# EAGLE design Shruthi-ControlPanel-v01 (EAGLE 5.07)
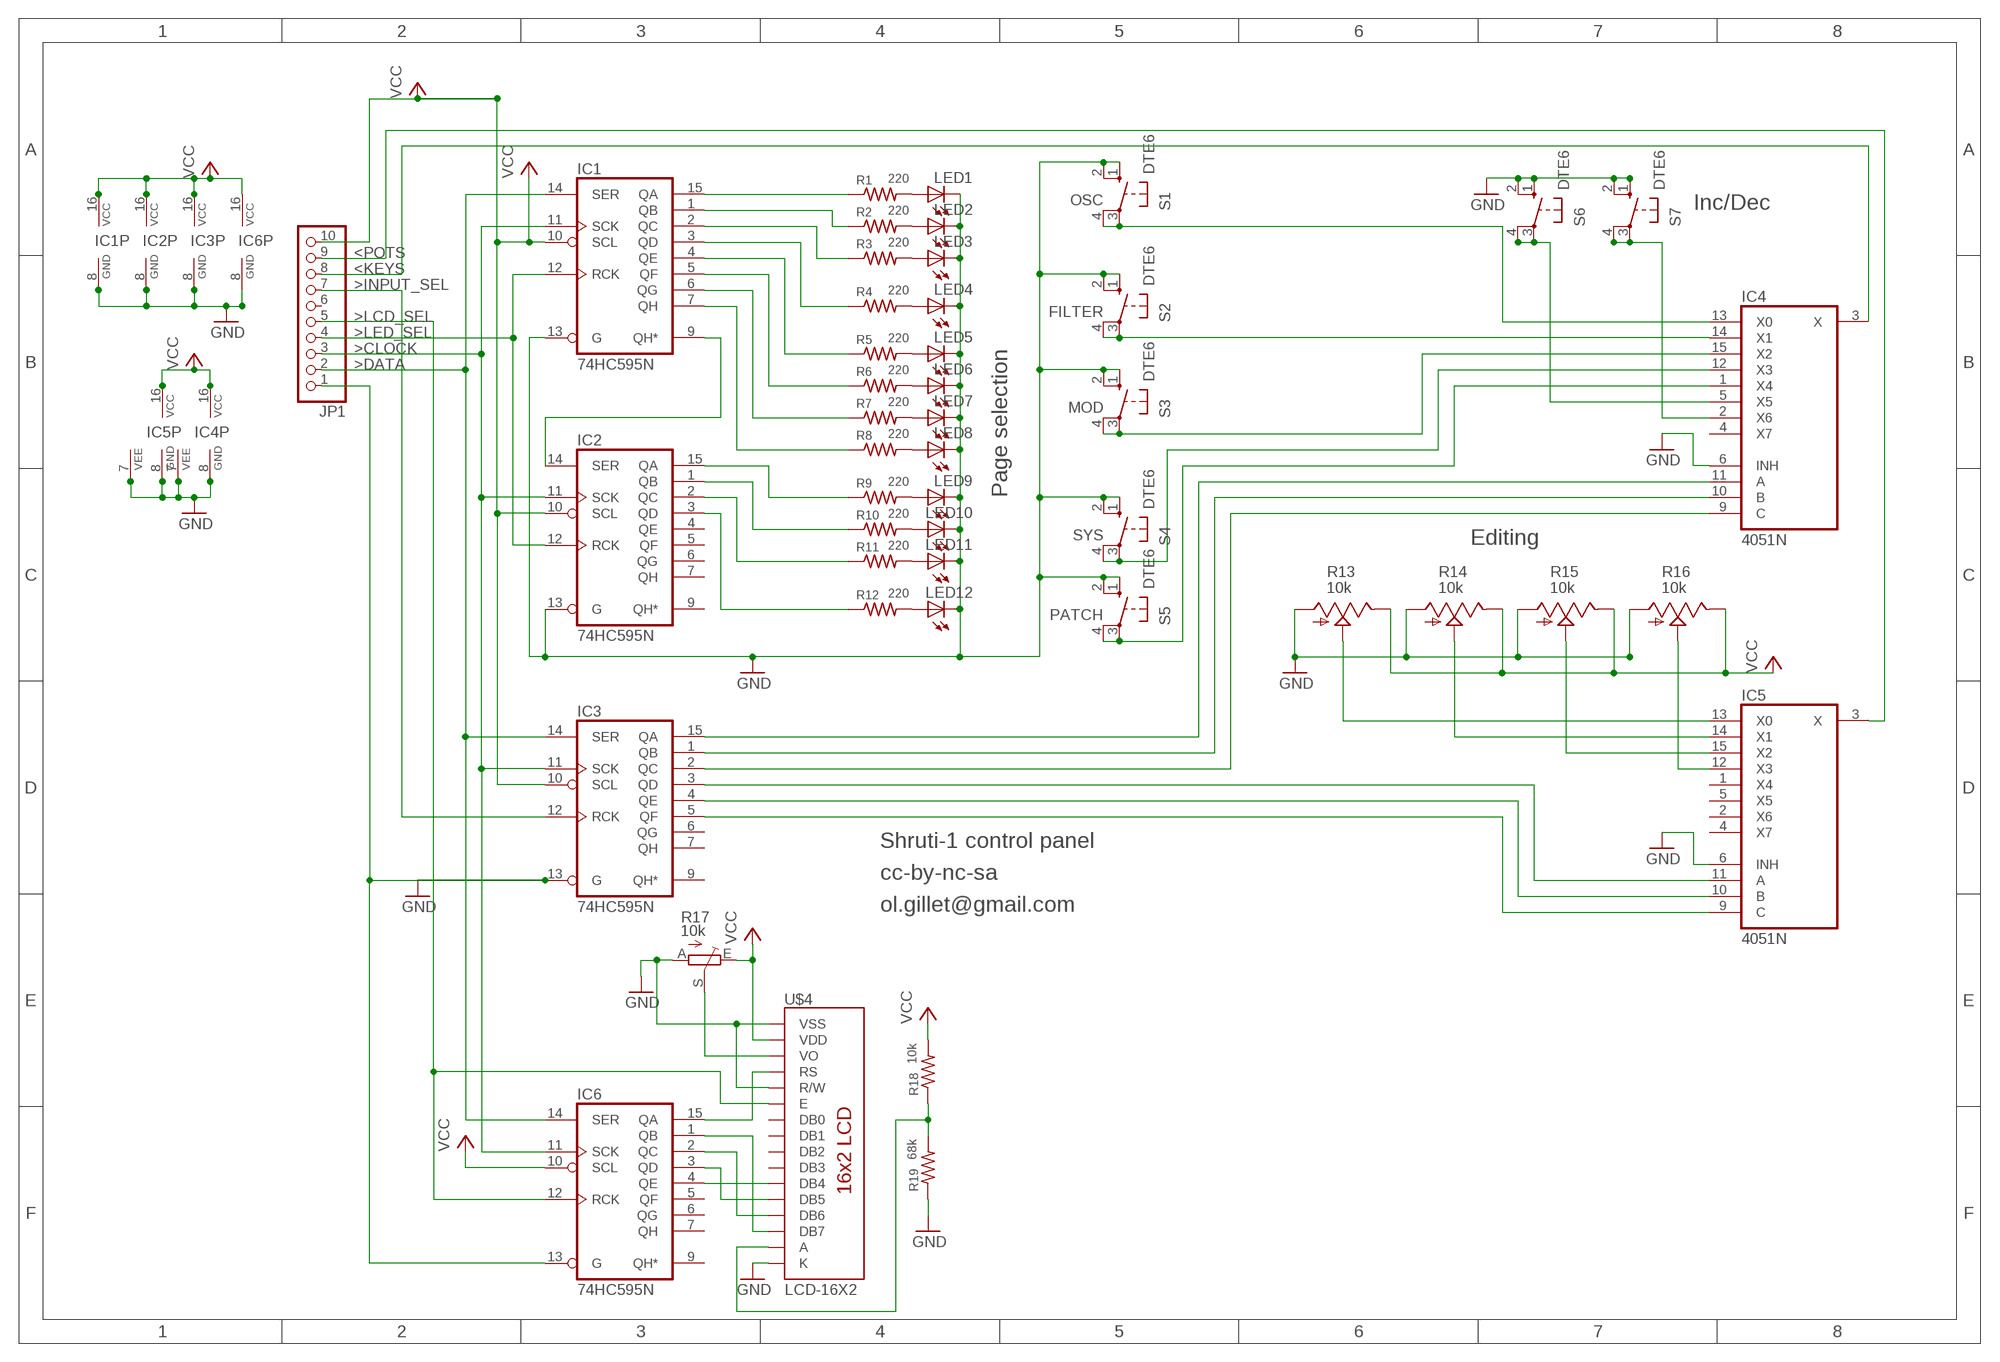
[diagram p0: schematic, sheet 1]

## Parts
IC1  74HC595N  [DIL16]
IC2  74HC595N  [DIL16]
IC3  74HC595N  [DIL16]
IC4  4051N  [DIL16]
IC5  4051N  [DIL16]
IC6  74HC595N  [DIL16]
JP1  PINHD-1X10  [1X10]
LED1  LED3MM  [LED3MM]
LED2  LED3MM  [LED3MM]
LED3  LED3MM  [LED3MM]
LED4  LED3MM  [LED3MM]
LED5  LED3MM  [LED3MM]
LED6  LED3MM  [LED3MM]
LED7  LED3MM  [LED3MM]
LED8  LED3MM  [LED3MM]
LED9  LED3MM  [LED3MM]
LED10  LED3MM  [LED3MM]
LED11  LED3MM  [LED3MM]
LED12  LED3MM  [LED3MM]
R1  220  R-US_0204/7  [0204/7]
R2  220  R-US_0204/7  [0204/7]
R3  220  R-US_0204/7  [0204/7]
R4  220  R-US_0204/7  [0204/7]
R5  220  R-US_0204/7  [0204/7]
R6  220  R-US_0204/7  [0204/7]
R7  220  R-US_0204/7  [0204/7]
R8  220  R-US_0204/7  [0204/7]
R9  220  R-US_0204/7  [0204/7]
R10  220  R-US_0204/7  [0204/7]
R11  220  R-US_0204/7  [0204/7]
R12  220  R-US_0204/7  [0204/7]
R13  10k  POT_US  [ALPS_POT_SFE]
R14  10k  POT_US  [ALPS_POT_SFE]
R15  10k  POT_US  [ALPS_POT_SFE]
R16  10k  POT_US  [ALPS_POT_SFE]
R17  10k  TRIM_EU-B25U  [B25U]
R18  10k  R-US_0204/7  [0204/7]
R19  68k  R-US_0204/7  [0204/7]
S1  DTE6  40-XX  [B3F-40XX]
S2  DTE6  40-XX  [B3F-40XX]
S3  DTE6  40-XX  [B3F-40XX]
S4  DTE6  40-XX  [B3F-40XX]
S5  DTE6  40-XX  [B3F-40XX]
S6  DTE6  40-XX  [B3F-40XX]
S7  DTE6  40-XX  [B3F-40XX]
U$4  LCD-16X2  [LCD-16X2]

## Nets
<KEYS: IC4.3(X) JP1.8
<POTS: IC5.3(X) JP1.9
>CLOCK: IC1.11(SCK) IC2.11(SCK) IC3.11(SCK) IC6.11(SCK) JP1.3
>DATA: IC1.14(SER) IC3.14(SER) IC6.14(SER) JP1.2
>INPUT_SEL: IC3.12(RCK) JP1.7
>LCD_SEL: IC6.12(RCK) JP1.5 U$4.6(E)
>LED_SEL: IC1.12(RCK) IC2.12(RCK) JP1.4
GND: IC1.8(GND) IC1.13(G) IC2.8(GND) IC2.13(G) IC3.8(GND) IC3.13(G) IC4.6(INH) IC4.7(VEE) IC4.8(GND) IC5.6(INH) IC5.7(VEE) IC5.8(GND) IC6.8(GND) IC6.13(G) JP1.1 LED1.K(C) LED2.K(C) LED3.K(C) LED4.K(C) LED5.K(C) LED6.K(C) LED7.K(C) LED8.K(C) LED9.K(C) LED10.K(C) LED11.K(C) LED12.K(C) R13.P$3(A) R14.P$3(A) R15.P$3(A) R16.P$3(A) R17.A R19.1 S1.1(S) S1.2(S1) S2.1(S) S2.2(S1) S3.1(S) S3.2(S1) S4.1(S) S4.2(S1) S5.1(S) S5.2(S1) S6.1(S) S6.2(S1) S7.1(S) S7.2(S1) U$4.1(VSS) U$4.5(R/W) U$4.16(K)
N$1: IC1.9(QH*) IC2.14(SER)
N$2: LED1.A R1.2
N$3: LED2.A R2.2
N$4: LED3.A R3.2
N$5: LED4.A R4.2
N$6: LED5.A R5.2
N$7: LED6.A R6.2
N$8: LED7.A R7.2
N$9: LED9.A R9.2
N$10: LED10.A R10.2
N$11: LED11.A R11.2
N$12: LED12.A R12.2
N$13: IC1.15(QA) R1.1
N$14: IC1.1(QB) R2.1
N$15: IC1.2(QC) R3.1
N$16: IC1.3(QD) R4.1
N$17: IC1.4(QE) R5.1
N$18: IC1.5(QF) R6.1
N$19: IC1.6(QG) R7.1
N$20: IC1.7(QH) R8.1
N$21: LED8.A R8.2
N$22: IC2.15(QA) R9.1
N$23: IC2.1(QB) R10.1
N$24: IC2.2(QC) R11.1
N$25: IC3.15(QA) IC4.11(A)
N$26: IC3.1(QB) IC4.10(B)
N$27: IC2.3(QD) R12.1
N$28: IC6.15(QA) U$4.4(RS)
N$29: R17.S U$4.3(VO)
N$30: IC6.1(QB) U$4.14(DB7)
N$31: IC3.2(QC) IC4.9(C)
N$32: IC3.3(QD) IC5.11(A)
N$33: IC3.4(QE) IC5.10(B)
N$34: IC3.5(QF) IC5.9(C)
N$35: IC5.13(X0) R13.P$2(S)
N$36: IC4.5(X5) S6.3(P) S6.4(P1)
N$37: IC5.14(X1) R14.P$2(S)
N$38: IC5.15(X2) R15.P$2(S)
N$39: IC5.12(X3) R16.P$2(S)
N$40: IC4.2(X6) S7.3(P) S7.4(P1)
N$41: IC4.13(X0) S1.3(P) S1.4(P1)
N$42: IC4.14(X1) S2.3(P) S2.4(P1)
N$43: IC4.15(X2) S3.3(P) S3.4(P1)
N$44: IC4.12(X3) S4.3(P) S4.4(P1)
N$45: IC4.1(X4) S5.3(P) S5.4(P1)
N$47: IC6.2(QC) U$4.13(DB6)
N$48: IC6.3(QD) U$4.12(DB5)
N$49: IC6.4(QE) U$4.11(DB4)
N$51: R18.1 R19.2 U$4.15(A)
VCC: IC1.10(SCL) IC1.16(VCC) IC2.10(SCL) IC2.16(VCC) IC3.10(SCL) IC3.16(VCC) IC4.16(VCC) IC5.16(VCC) IC6.10(SCL) IC6.16(VCC) JP1.10 R13.P$1(E) R14.P$1(E) R15.P$1(E) R16.P$1(E) R17.E R18.2 U$4.2(VDD)
Unconnected: IC2.4(QE) IC2.5(QF) IC2.6(QG) IC2.7(QH) IC2.9(QH*) IC3.6(QG) IC3.7(QH) IC3.9(QH*) IC4.4(X7) IC5.1(X4) IC5.2(X6) IC5.4(X7) IC5.5(X5) IC6.5(QF) IC6.6(QG) IC6.7(QH) IC6.9(QH*) JP1.6 U$4.7(DB0) U$4.8(DB1) U$4.9(DB2) U$4.10(DB3)

## Notes on the sheet
- OSC
- Inc/Dec
- FILTER
- MOD
- Page selection
- SYS
- Editing
- PATCH
- Shruti-1 control panel
- cc-by-nc-sa
- ol.gillet@gmail.com

## Library data of the parts
IC1-IC3 IC6 = 74xx-eu:74*595: 8-bit SHIFT REGISTER, output latch
IC4 IC5 = 40xx:4051: 8-channel ANALOG MULTIPLEXER
JP1 = pinhead:PINHD-1X10: PIN HEADER
LED1-LED12 = led:LED: LED OSRAM: - CHIPLED LG R971, LG N971, LY N971, LG Q971, LY Q971, LO R971, LY R971 LH N974, LH R974 LS Q976, LO Q976, LY Q976 LO Q996 - Hyper CHIPLED LW Q18S LB Q993, LB Q99A, LB R99A - SideLED LS A670, LO A670, LY A670, LG A670, LP A670 LB A673, LV A673, LT A673, LW A673 LH A674 LY A675 LS A676, LA A676, LO A676, LY A676, LW A676 LS A679, LY A679, LG A679 - Hyper Micro SIDELED® LS Y876, LA Y876, LO Y876, LY Y876 LT Y87S - SmartLED LW L88C, LW L88S LB L89C, LB L89S, LG L890 LS L89K, LO L89K, LY L89K LS L896, LA L896, LO L896, LY L896 - TOPLED LS T670, LO T670, LY T670, LG T670, LP T670 LSG T670, LSP T670, LSY T670, LOP T670, LYG T670 LG T671, LOG T671, LSG T671 LB T673, LV T673, LT T673, LW T673 LH T674 LS T676, LA T676, LO T676, LY T676, LB T676, LH T676, LSB T676, LW T676 LB T67C, LV T67C, LT T67C, LS T67K, LO T67K, LY T67K, LW E67C LS E67B, LA E67B, LO E67B, LY E67B, LB E67C, LV E67C, LT E67C LW T67C LS T679, LY T679, LG T679 LS T770, LO T770, LY T770, LG T770, LP T770 LB T773, LV T773, LT T773, LW T773 LH T774 LS E675, LA E675, LY E675, LS T675 LS T776, LA T776, LO T776, LY T776, LB T776 LHGB T686 LT T68C, LB T68C - Hyper Mini TOPLED® LB M676 - Mini TOPLED Santana® LG M470 LS M47K, LO M47K, LY M47K Source: http://www.osram.convergy.de LUXEON: - LUMILED® LXK2-PW12-R00, LXK2-PW12-S00, LXK2-PW14-U00, LXK2-PW14-V00 LXK2-PM12-R00, LXK2-PM12-S00, LXK2-PM14-U00 LXK2-PE12-Q00, LXK2-PE12-R00, LXK2-PE12-S00, LXK2-PE14-T00, LXK2-PE14-U00 LXK2-PB12-K00, LXK2-PB12-L00, LXK2-PB12-M00, LXK2-PB14-N00, LXK2-PB14-P00, LXK2-PB14-Q00 LXK2-PR12-L00, LXK2-PR12-M00, LXK2-PR14-Q00, LXK2-PR14-R00 LXK2-PD12-Q00, LXK2-PD12-R00, LXK2-PD12-S00 LXK2-PH12-R00, LXK2-PH12-S00 LXK2-PL12-P00, LXK2-PL12-Q00, LXK2-PL12-R00 Source: www.luxeon.com KINGBRIGHT: KA-3528ASYC Source: www.kingbright.com
R1-R12 R18 R19 = resistor:R-US_: RESISTOR, American symbol
R13-R16 = pot-alps:POT_US
R17 = pot:TRIM_EU-: POTENTIOMETER
S1-S7 = switch-omron:40-XX: OMRON SWITCH
U$4 = SparkFun:LCD-16X2

## Board
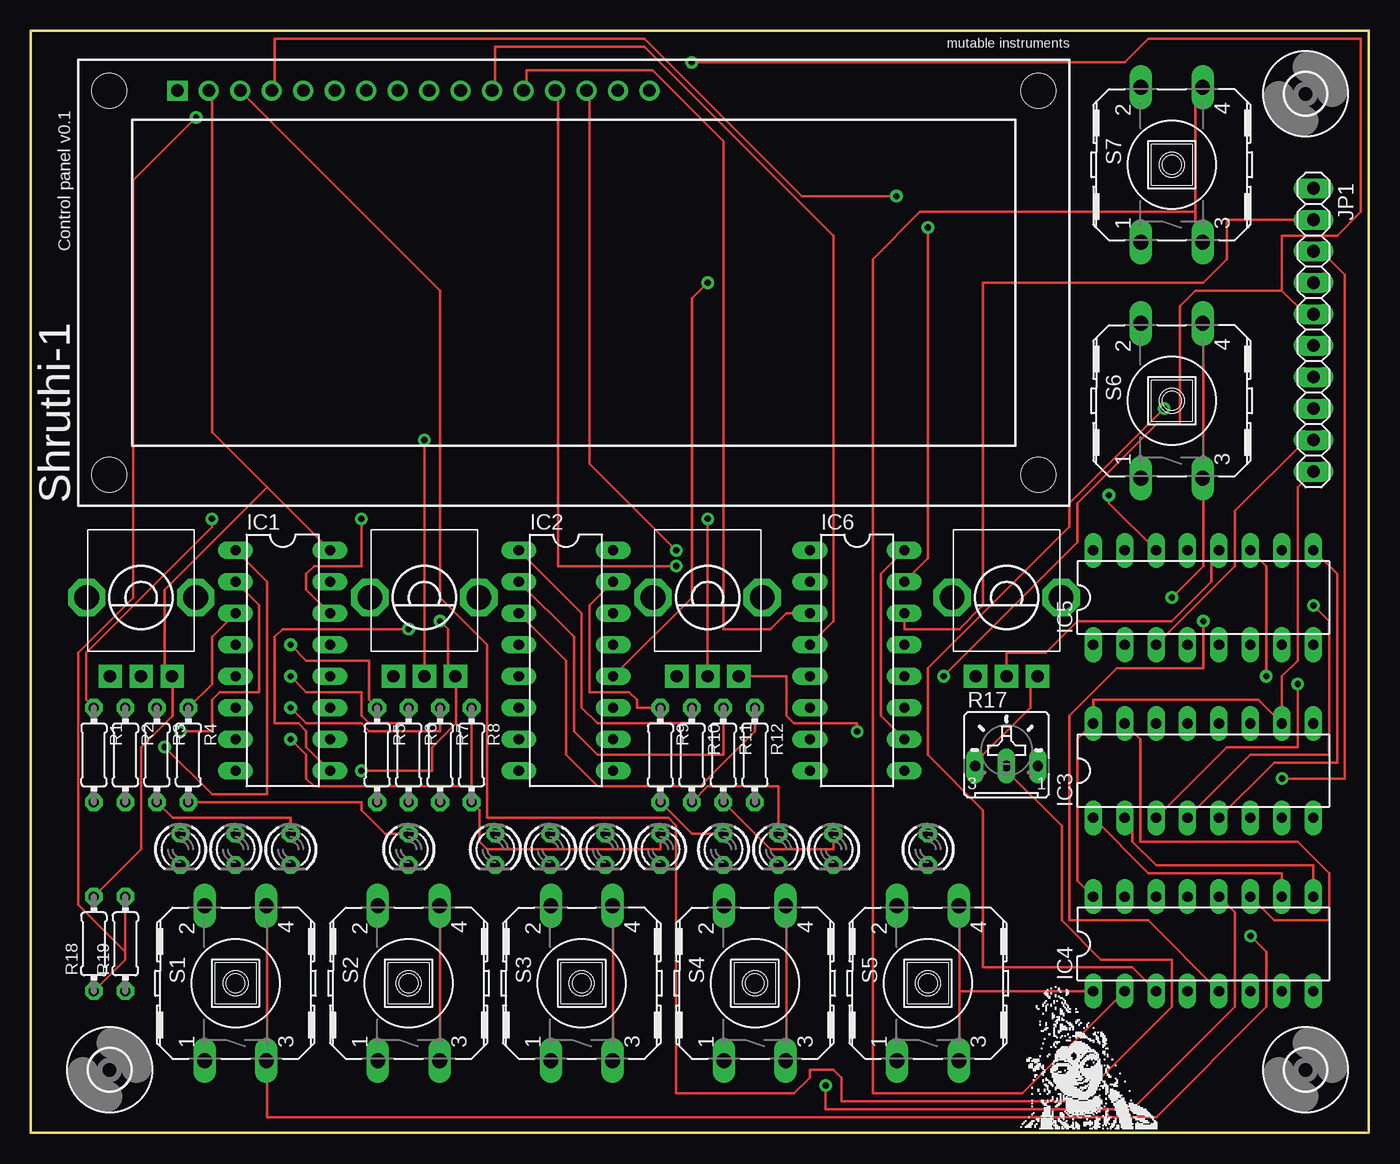
[diagram p1: board, top side]
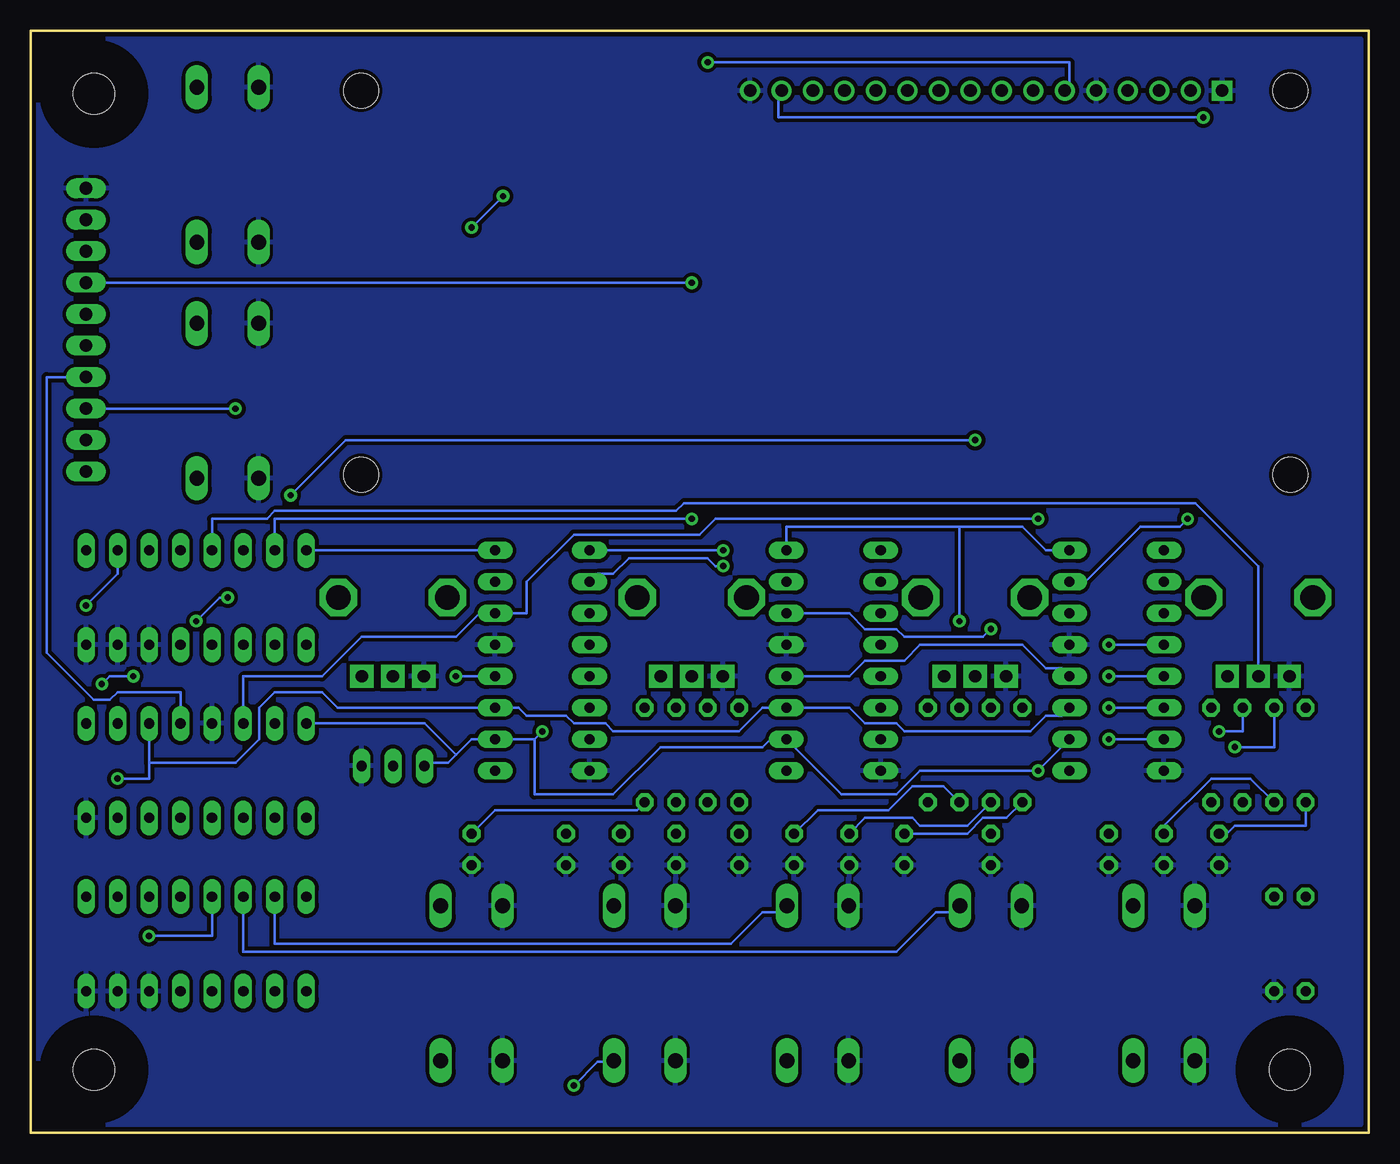
[diagram p2: board, bottom side, seen from below]

Size 107.95 x 88.89 mm. Coordinates in mm from the lower left corner, seen from the top.
Outline: 107.95,0 107.95,88.89 0,88.89 0,0 107.95,0
Copper layers (1*16): Top 0.035mm / dielectric 1.5mm / Bottom 0.035mm
Design rules "SparkFun *": minimum track width 8mil, minimum drill 20mil, track to track 8mil, track to pad 14mil, pad to pad 8mil, via to via 8mil, smd to smd 8mil, copper to edge 10mil, drill to drill 8mil, minimum pad ring 12mil, minimum via ring 10mil, stop-mask expansion 4mil, vias tented up to drill 25mil, thermal gap 10mil

### Footprints (pad centres in the part's own frame; a part is rotated, then mirrored left to right if it is on the bottom)
DIL16 = drill 0.813 long: 1 -8.89,-3.81; 2 -6.35,-3.81; 3 -3.81,-3.81; 4 -1.27,-3.81; 5 1.27,-3.81; 6 3.81,-3.81; 7 6.35,-3.81; 8 8.89,-3.81; 9 8.89,3.81; 10 6.35,3.81; 11 3.81,3.81; 12 1.27,3.81; 13 -1.27,3.81; 14 -3.81,3.81; 15 -6.35,3.81; 16 -8.89,3.81
1X10 = drill 1.016 long: 1 -11.43,0; 2 -8.89,0; 3 -6.35,0; 4 -3.81,0; 5 -1.27,0; 6 1.27,0; 7 3.81,0; 8 6.35,0; 9 8.89,0; 10 11.43,0
LED3MM = drill 0.813 octagon: A -1.27,0; K 1.27,0
0204/7 = drill 0.813 octagon: 1 -3.81,0; 2 3.81,0
ALPS_POT_SFE = drill 1 pad 1.88 square: P$1 -2.5,6.35; P$2 0,6.35; P$3 2.5,6.35 | drill 2 octagon: P$4 -4.4,0; P$5 4.4,0
B25U = drill 0.813 long: A 2.54,-0.889; E -2.54,-0.889; S 0,-0.889
B3F-40XX = drill 1.194 long: 1 -6.248,2.489; 2 6.248,2.489; 3 -6.248,-2.489; 4 6.248,-2.489
3,3 = hole 3.3: 0,0
LCD-16X2 = drill 1.016 square: 1 -32,15.5 | drill 1.016 round: 2 -29.46,15.5; 3 -26.92,15.5; 4 -24.38,15.5; 5 -21.84,15.5; 6 -19.3,15.5; 7 -16.76,15.5; 8 -14.22,15.5; 9 -11.68,15.5; 10 -9.14,15.5; 11 -6.6,15.5; 12 -4.06,15.5; 13 -1.52,15.5; 14 1.02,15.5; 15 3.56,15.5; 16 6.1,15.5 | hole 2.8: -37.5,15.5; -37.5,-15.5; 37.5,15.5; 37.5,-15.5

### Placement (x,y rotation side)
IC1  20.32,38.1 270 top
IC2  43.18,38.1 270 top
IC3  94.62,29.21 0 top
IC4  94.62,15.24 0 top
IC5  94.62,43.18 0 top
IC6  66.68,38.1 270 top
JP1  103.51,64.77 270 top
LED1  12.07,22.86 270 top
LED2  16.51,22.86 270 top
LED3  20.95,22.86 270 top
LED4  30.48,22.86 270 top
LED5  37.46,22.86 270 top
LED6  41.91,22.86 270 top
LED7  46.35,22.86 270 top
LED8  50.8,22.86 270 top
LED9  55.88,22.86 270 top
LED10  60.32,22.86 270 top
LED11  64.77,22.86 270 top
LED12  72.39,22.86 270 top
R1  5.08,30.48 270 top
R2  7.62,30.48 270 top
R3  10.16,30.48 270 top
R4  12.7,30.48 270 top
R5  27.94,30.48 270 top
R6  30.48,30.48 270 top
R7  33.02,30.48 270 top
R8  35.56,30.48 270 top
R9  50.8,30.48 270 top
R10  53.34,30.48 270 top
R11  55.88,30.48 270 top
R12  58.42,30.48 270 top
R13  8.89,43.18 180 top
R14  31.75,43.18 180 top
R15  54.61,43.18 180 top
R16  78.74,43.18 180 top
R17  78.74,30.48 0 top
R18  5.08,15.24 90 top
R19  7.62,15.24 90 top
S1  16.51,12.07 90 top
S2  30.48,12.07 90 top
S3  44.45,12.07 90 top
S4  58.42,12.07 90 top
S5  72.39,12.07 90 top
S6  92.08,59.05 90 top
S7  92.08,78.11 90 top
U$1  [3,3]  102.87,83.82 0 top
U$3  [3,3]  6.35,5.08 0 top
U$4  43.81,68.58 0 top
U$5  [3,3]  102.87,5.08 0 top

### Tracks (layer width: path | path; a pad name or v marks a point on that pad's centre or on a via)
<KEYS  (via drill 0.51)
  Top 0.203: IC4.3 88.9,13.34 76.84,13.34 76.84,26.04 72.39,30.48 72.39,37.47 83.82,48.9 83.82,50.8 v91.44,58.42
  Bottom 0.203: v91.44,58.42 JP1.8
<POTS
  Top 0.203: IC5.3 97.16,45.72 97.16,50.16 102.87,55.88 JP1.9
>CLOCK  (via drill 0.51)
  Top 0.203: v100.97,28.57 106.05,28.57 106.05,69.22 104.14,71.12 JP1.3
  Bottom 0.203: IC1.11 24.77,33.66 26.04,33.66 27.3,32.38 37.46,32.38 38.1,33.02 40.64,33.02 41.91,34.29 IC2.11 48.89,34.29 50.8,32.38 60.96,32.38 61.59,33.02 64.14,33.02 64.77,33.66 67.95,33.66 68.58,34.29 IC6.11 83.19,34.29 84.46,35.56 88.27,35.56 89.54,34.29 89.54,31.75 91.44,29.84 98.43,29.84 | 98.43,29.84 98.43,28.57 v100.97,28.57 | 98.43,29.84 IC3.11
>DATA  (via drill 0.51)
  Top 0.203: IC1.14 22.22,43.82 22.22,45.09 22.86,45.72 26.67,45.72 v26.67,49.53 | JP1.2 96.52,73.66 96.52,70.48 94.62,68.58 76.84,68.58 76.84,42.55 74.93,40.64 70.48,40.64 IC6.14
  Bottom 0.203: v26.67,49.53 52.7,49.53 53.98,48.26 64.14,48.26 67.95,44.45 67.95,41.91 IC6.14 71.76,41.91 73.66,40.01 81.28,40.01 84.46,36.83 90.81,36.83 IC3.14
>INPUT_SEL
  Bottom 0.203: IC3.12 95.89,35.56 100.97,35.56 101.6,34.92 102.87,34.92 106.68,38.73 106.68,60.96 JP1.7
>LCD_SEL  (via drill 0.51)
  Top 0.203: v73.66,36.83 84.46,47.62 84.46,50.8 90.81,57.15 92.71,57.15 92.71,66.67 93.98,67.95 100.97,67.95 | 100.97,67.95 102.87,66.04 JP1.5 | v53.34,86.36 88.27,86.36 90.17,88.27 107.32,88.27 107.32,74.3 105.41,72.39 100.97,72.39 100.97,67.95
  Bottom 0.203: IC6.12 v73.66,36.83 | v53.34,86.36 24.13,86.36 24.13,84.45 U$4.6
>LED_SEL  (via drill 0.51)
  Top 0.203: v54.61,68.58 53.34,67.31 53.34,43.18 IC2.12
  Bottom 0.203: IC1.12 24.77,37.47 26.04,37.47 27.94,39.37 36.2,39.37 37.46,38.1 40.64,38.1 41.91,36.83 IC2.12 | v54.61,68.58 JP1.4
GND
  pour Bottom (isolate 0.305): 0.64,88.27 0.64,0.64 107.32,0.64 107.32,88.27
N$1  (via drill 0.51)
  Top 0.203: IC1.9 22.22,31.11 22.22,32.38 21.59,33.02 19.68,33.02 19.68,40.01 20.32,40.64 v30.48,40.64
  Bottom 0.203: v30.48,40.64 31.11,40.01 37.46,40.01 38.1,40.64 40.64,40.64 41.91,41.91 IC2.14
N$2
  Bottom 0.203: R1.2 5.08,24.76 10.8,24.76 11.43,24.13 LED1.A
N$3
  Bottom 0.203: R2.2 9.53,28.57 12.7,28.57 16.51,24.76 LED2.A
N$4
  Top 0.203: R3.2 11.43,25.4 20.95,25.4 LED3.A
N$5
  Top 0.203: R4.2 26.67,26.67 26.67,26.04 28.57,24.13 LED4.A
N$6
  Bottom 0.203: R5.2 29.21,25.4 31.11,25.4 32.38,24.13 LED5.A
N$7
  Bottom 0.203: R6.2 32.38,24.76 36.2,24.76 36.83,25.4 40.64,25.4 LED6.A
N$8
  Bottom 0.203: R7.2 34.29,27.94 36.83,27.94 38.73,26.04 44.45,26.04 LED7.A
N$9
  Top 0.203: R9.2 53.34,24.13 LED9.A
N$10
  Top 0.203: R10.2 54.61,27.94 60.32,27.94 LED10.A
N$11
  Top 0.203: R11.2 59.69,22.86 64.77,22.86 LED11.A
N$12
  Bottom 0.203: R12.2 59.05,26.04 70.48,26.04 LED12.A
N$13  (via drill 0.51)
  Top 0.203: R1.1 4.45,34.92 4.45,38.73 14.61,48.9 v14.61,49.53
  Bottom 0.203: v14.61,49.53 15.24,48.9 18.41,48.9 22.86,44.45 IC1.15
N$14  (via drill 0.51)
  Top 0.203: v10.8,31.11 14.61,27.3 19.05,27.3 19.05,44.45 IC1.1
  Bottom 0.203: R2.1 7.62,31.11 v10.8,31.11
N$15  (via drill 0.51)
  Top 0.203: v12.07,32.38 14.61,32.38 14.61,34.92 15.24,35.56 18.41,35.56 18.41,42.55 IC1.2
  Bottom 0.203: R3.1 10.16,32.38 v12.07,32.38
N$16
  Top 0.203: R4.1 14.61,36.2 14.61,40.01 IC1.3
N$17  (via drill 0.51)
  Top 0.203: v20.95,39.37 22.22,38.1 27.3,38.1 27.3,34.92 R5.1
  Bottom 0.203: IC1.4 v20.95,39.37
N$18  (via drill 0.51)
  Top 0.203: v20.95,36.83 22.22,35.56 26.67,35.56 26.67,33.66 27.3,33.02 30.48,33.02 R6.1
  Bottom 0.203: IC1.5 v20.95,36.83
N$19  (via drill 0.51)
  Top 0.203: v20.95,34.29 22.22,33.02 26.67,33.02 27.3,32.38 33.02,32.38 R7.1
  Bottom 0.203: IC1.6 v20.95,34.29
N$20  (via drill 0.51)
  Top 0.203: v20.95,31.75 22.22,30.48 22.22,28.57 22.86,27.94 35.56,27.94 R8.1
  Bottom 0.203: IC1.7 v20.95,31.75
N$21
  Top 0.203: R8.2 36.2,26.04 36.2,23.49 36.83,22.86 50.8,22.86 LED8.A
N$22
  Top 0.203: R9.1 48.89,34.29 48.89,34.92 48.26,35.56 45.09,35.56 45.09,42.55 IC2.15
N$23
  Top 0.203: IC2.1 44.45,41.91 44.45,34.29 45.72,33.02 53.34,33.02 R10.1
N$24
  Top 0.203: IC2.2 43.81,40.01 43.81,32.38 45.72,30.48 55.88,30.48 R11.1
N$25
  Top 0.203: IC4.11 100.33,17.14 104.78,17.14 104.78,20.95 102.23,23.49 89.54,23.49 89.54,31.75 IC3.15
N$26
  Top 0.203: IC3.1 90.17,20.95 100.97,20.95 IC4.10
N$27
  Top 0.203: IC2.3 43.18,38.1 43.18,30.48 45.72,27.94 53.98,27.94 58.42,32.38 R12.1
N$28  (via drill 0.51)
  Top 0.203: IC6.15 72.39,46.36 v72.39,73.03 | v69.85,75.56 62.23,75.56 49.53,88.27 19.68,88.27 19.68,84.45 U$4.4
  Bottom 0.203: v69.85,75.56 v72.39,73.03
N$29
  Top 0.203: R17.S 78.74,29.21 83.19,24.76 83.19,17.14 86.36,13.97 92.08,13.97 92.08,10.16 84.46,2.54 65.41,2.54 65.41,4.45 64.77,5.08 62.87,5.08 62.87,4.45 61.59,3.17 52.07,3.17 52.07,24.76 51.44,25.4 36.83,25.4 36.83,39.37 33.02,43.18 33.02,67.95 17.14,83.82 U$4.3
N$30  (via drill 0.51)
  Top 0.203: v52.07,46.99 45.09,53.98 45.09,83.82 U$4.14
  Bottom 0.203: v52.07,46.99 IC6.1
N$31
  Top 0.203: IC3.2 88.9,24.76 88.9,23.49 90.81,21.59 103.51,21.59 IC4.9
N$32  (via drill 0.51)
  Top 0.203: IC3.3 96.52,31.11 102.23,31.11 v102.23,36.2 | v99.7,36.83 99.7,45.72 IC5.11
  Bottom 0.203: v102.23,36.2 101.6,36.83 v99.7,36.83
N$33  (via drill 0.51)
  Top 0.203: IC3.4 98.43,30.48 104.78,30.48 104.78,41.28 v103.51,42.55
  Bottom 0.203: v103.51,42.55 100.97,45.09 IC5.10
N$34
  Top 0.203: IC3.5 100.33,29.84 105.41,29.84 105.41,45.09 IC5.9
N$35
  Bottom 0.203: IC5.13 93.35,49.53 88.9,49.53 88.27,50.16 55.88,50.16 55.24,50.8 13.97,50.8 8.89,45.72 R13.P$2
N$36  (via drill 0.51)
  Top 0.203: IC4.5 90.17,17.14 83.82,17.14 83.82,33.66 87.63,37.47 94.62,37.47 v94.62,41.28 | v92.08,43.18 94.62,45.72 94.62,52.71 S6.3 94.62,53.34 94.62,64.77 S6.4
  Bottom 0.203: v94.62,41.28 92.71,43.18 v92.08,43.18
N$37  (via drill 0.51)
  Top 0.203: IC5.14 87,50.8 v87,51.44 | R14.P$2 v31.75,55.88
  Bottom 0.203: v87,51.44 82.55,55.88 v31.75,55.88
N$38  (via drill 0.51)
  Top 0.203: R15.P$2 v54.61,49.53
  Bottom 0.203: IC5.15 88.27,49.53 v54.61,49.53
N$39
  Top 0.203: IC5.12 95.25,46.36 95.25,44.45 92.08,41.28 84.46,41.28 81.92,38.73 78.74,38.73 R16.P$2
N$40
  Top 0.203: IC4.2 80.01,3.17 67.95,3.17 67.95,70.48 71.76,74.3 93.98,74.3 | 93.98,74.3 93.98,72.39 S7.3 | 93.98,74.3 93.98,83.82 S7.4
N$41  (via drill 0.51)
  Top 0.203: v98.43,15.88 99.7,14.61 99.7,10.16 90.81,1.27 19.05,1.27 19.05,5.71 S1.3 19.05,6.35 19.05,17.78 S1.4
  Bottom 0.203: IC4.13 93.35,15.88 v98.43,15.88
N$42
  Top 0.203: S2.3 33.02,6.35 33.02,17.78 S2.4
  Bottom 0.203: IC4.14 90.81,14.61 38.1,14.61 34.92,17.78 33.02,17.78 S2.4
N$43
  Top 0.203: S3.3 46.99,6.35 46.99,17.78 S3.4
  Bottom 0.203: IC4.15 88.27,15.24 51.44,15.24 48.89,17.78 46.99,17.78 S3.4
N$44  (via drill 0.51)
  Top 0.203: IC4.12 97.16,17.78 97.16,10.16 88.9,1.91 64.14,1.91 v64.14,3.81 | S4.4 60.96,17.78 60.96,6.35 S4.3
  Bottom 0.203: v64.14,3.81 62.23,5.71 60.96,5.71 S4.3
N$45
  Top 0.203: 74.93,11.43 IC4.1 | 74.93,11.43 74.93,6.35 S5.3 | 74.93,11.43 74.93,17.78 S5.4
N$47  (via drill 0.51)
  Top 0.203: v52.07,45.72 42.55,45.72 42.55,83.82 U$4.13
  Bottom 0.203: IC6.2 62.23,45.09 60.96,45.09 59.69,46.36 53.34,46.36 52.7,45.72 v52.07,45.72
N$48
  Top 0.203: IC6.3 60.96,41.91 59.69,40.64 55.88,40.64 55.88,80.01 50.16,85.73 40.01,85.73 40.01,84.45 U$4.12
N$49
  Top 0.203: IC6.4 64.77,41.28 64.77,72.39 49.53,87.63 37.46,87.63 37.46,84.45 U$4.11
N$51  (via drill 0.51)
  Top 0.203: R18.1 7.62,13.97 7.62,14.61 | 7.62,14.61 R19.2 | v13.34,81.92 8.25,76.84 8.25,43.18 3.81,38.73 3.81,18.41 7.62,14.61
  Bottom 0.203: v13.34,81.92 47.62,81.92 47.62,83.82 U$4.15
VCC  (via drill 0.51)
  Top 0.203: R17.E 76.2,29.84 80.65,34.29 80.65,36.83 R16.P$1 | IC6.16 68.58,45.09 68.58,33.66 IC6.10 | v66.68,32.38 66.68,33.02 61.59,33.02 60.96,33.66 60.96,36.83 R15.P$1 | IC4.16 84.46,20.32 84.46,31.75 IC3.16 85.73,34.92 99.06,34.92 IC3.10 100.97,36.83 102.23,38.1 102.23,52.07 JP1.10 | v26.67,29.21 32.38,29.21 32.38,31.11 34.29,33.02 34.29,36.83 R14.P$1 33.66,36.83 33.66,40.64 v33.02,41.28 | R18.2 8.89,22.86 8.89,31.11 11.43,33.66 11.43,36.83 R13.P$1 10.8,36.83 10.8,43.82 19.05,52.07 | 19.05,52.07 14.61,56.52 14.61,83.82 U$4.2 | 19.05,52.07 IC1.16
  Bottom 0.203: 73.66,30.48 74.3,29.84 76.2,29.84 R17.E | 73.66,30.48 72.39,31.75 IC6.10 67.31,31.75 | IC6.16 IC5.16 | 67.31,31.75 v66.68,32.38 | 73.66,30.48 76.2,33.02 IC3.16 | IC1.10 v26.67,29.21 36.2,29.21 38.1,27.3 42.55,27.3 IC2.10 48.26,31.75 48.89,31.11 57.15,31.11 60.96,27.3 67.31,27.3 67.31,31.75 | IC2.16 46.99,48.9 33.02,48.9 | 33.02,48.9 27.94,48.9 26.04,46.99 IC1.16 | 33.02,48.9 v33.02,41.28

### Text on the board
tPlace: Shruthi-1
tNames: mutable instruments | Control panel v0.1
License: ol.gillet@gmail.com | cc-by-nc-sa 3.0